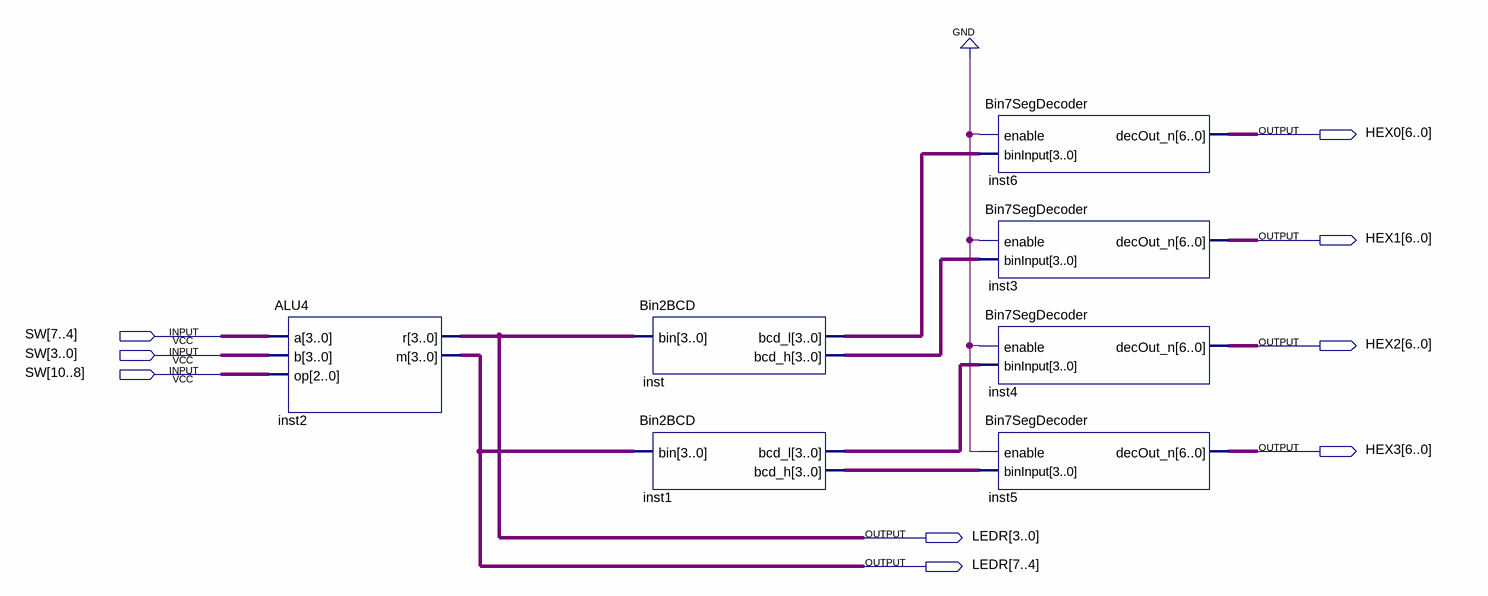
[diagram p0: schematic sheet]
// Quartus schematic ALUDemo.bdf as structural Verilog: 7 symbols, 9 pins
module ALUDemo (
  input  [10:0] SW,
  output [6:0] HEX0,
  output [6:0] HEX1,
  output [6:0] HEX2,
  output [6:0] HEX3,
  output [7:0] LEDR
);

  wire [3:0] inst1_bcd_h, inst1_bcd_l, inst_bcd_h, inst_bcd_l;

  ALU4 inst2 (.a(SW[7:4]), .b(SW[3:0]), .op(SW[10:8]), .r(LEDR[3:0]), .m(LEDR[7:4]));
  Bin2BCD inst (.bin(LEDR[3:0]), .bcd_l(inst_bcd_l), .bcd_h(inst_bcd_h));
  Bin2BCD inst1 (.bin(LEDR[7:4]), .bcd_l(inst1_bcd_l), .bcd_h(inst1_bcd_h));
  Bin7SegDecoder inst6 (.enable(1'b0), .binInput(inst_bcd_l), .decOut_n(HEX0));
  Bin7SegDecoder inst3 (.enable(1'b0), .binInput(inst_bcd_h), .decOut_n(HEX1));
  Bin7SegDecoder inst4 (.enable(1'b0), .binInput(inst1_bcd_l), .decOut_n(HEX2));
  Bin7SegDecoder inst5 (.enable(1'b0), .binInput(inst1_bcd_h), .decOut_n(HEX3));
endmodule
